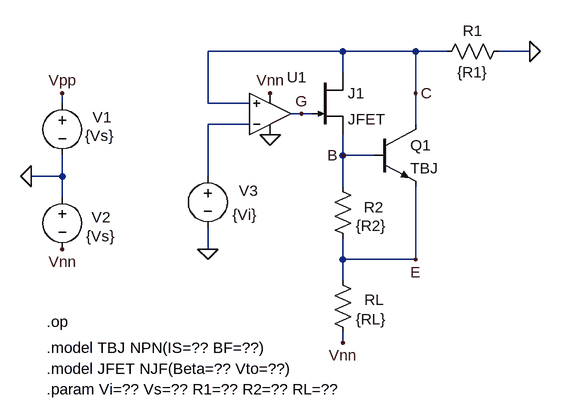
[diagram p0: schematic COMB07opFig.asc]
COMB07opFig.asc, the LTspice schematic file:
Version 4
SHEET 1 2180 1076
WIRE 784 -208 576 -208
WIRE 896 -208 784 -208
WIRE 944 -208 896 -208
WIRE 1072 -208 1024 -208
WIRE 784 -176 784 -208
WIRE 896 -144 896 -208
WIRE 352 -128 352 -144
WIRE 576 -128 576 -208
WIRE 640 -128 576 -128
WIRE 720 -112 704 -112
WIRE 736 -112 720 -112
WIRE 640 -96 576 -96
WIRE 896 -96 896 -144
WIRE 784 -48 784 -80
WIRE 832 -48 784 -48
WIRE 352 -16 352 -48
WIRE 352 -16 304 -16
WIRE 576 -16 576 -96
WIRE 784 0 784 -48
WIRE 352 16 352 -16
WIRE 576 96 576 64
WIRE 784 112 784 80
WIRE 896 112 896 0
WIRE 896 112 784 112
WIRE 784 144 784 112
WIRE 784 240 784 224
FLAG 352 -144 Vpp
FLAG 304 -16 0
FLAG 352 96 Vnn
FLAG 784 -48 B
FLAG 896 -144 C
FLAG 720 -112 G
FLAG 896 112 E
FLAG 576 96 0
FLAG 784 240 Vnn
FLAG 1072 -208 0
FLAG 672 -144 Vnn
FLAG 672 -80 0
SYMBOL voltage 352 -144 R0
WINDOW 123 0 0 Left 0
WINDOW 39 0 0 Left 0
WINDOW 0 47 37 Left 2
WINDOW 3 35 66 Left 2
SYMATTR InstName V1
SYMATTR Value {Vs}
SYMBOL voltage 352 0 R0
WINDOW 123 0 0 Left 0
WINDOW 39 0 0 Left 0
WINDOW 0 45 47 Left 2
WINDOW 3 37 76 Left 2
SYMATTR InstName V2
SYMATTR Value {Vs}
SYMBOL njf 736 -176 R0
SYMATTR InstName J1
SYMATTR Value JFET
SYMBOL res 768 -16 R0
WINDOW 0 48 48 Left 2
SYMATTR InstName R2
SYMATTR Value {R2}
SYMBOL res 1040 -224 R90
WINDOW 0 0 56 VBottom 2
WINDOW 3 32 56 VTop 2
SYMATTR InstName R1
SYMATTR Value {R1}
SYMBOL npn 832 -96 R0
SYMATTR InstName Q1
SYMATTR Value TBJ
SYMBOL res 768 128 R0
WINDOW 0 49 46 Left 2
SYMATTR InstName RL
SYMATTR Value {RL}
SYMBOL OpAmps\\UniversalOpAmp2 672 -112 M180
WINDOW 0 26 56 Left 2
SYMATTR InstName U1
SYMBOL voltage 576 -32 R0
WINDOW 123 0 0 Left 0
WINDOW 39 0 0 Left 0
WINDOW 0 48 38 Left 2
WINDOW 3 38 75 Left 2
SYMATTR InstName V3
SYMATTR Value {Vi}
TEXT 328 208 Left 2 !.op
TEXT 328 280 Left 2 !.model JFET NJF(Beta=?? Vto=??)
TEXT 328 312 Left 2 !.param Vi=?? Vs=?? R1=?? R2=?? RL=??
TEXT 328 248 Left 2 !.model TBJ NPN(IS=?? BF=??)

The netlist it stands for:
* COMB07opFig.asc
V1 Vpp 0 {Vs}
V2 0 Vnn {Vs}
J1 C G B JFET
R2 B E {R2}
R1 0 C {R1}
Q1 C B E 0 TBJ
RL E Vnn {RL}
XU1 C N001 0 Vnn G level2 Avol=1Meg GBW=10Meg Slew=10Meg Ilimit=25m Rail=0 Vos=0 En=0 Enk=0 In=0 Ink=0 Rin=500Meg  ; pins In+ In- V+ V- OUT
V3 N001 0 {Vi}
.model NPN NPN
.model PNP PNP
.lib standard.bjt
.model NJF NJF
.model PJF PJF
.lib standard.jft
.op
.model JFET NJF(Beta=?? Vto=??)
.param Vi=?? Vs=?? R1=?? R2=?? RL=??
.model TBJ NPN(IS=?? BF=??)
.lib UniversalOpAmp2.lib
.backanno
.end